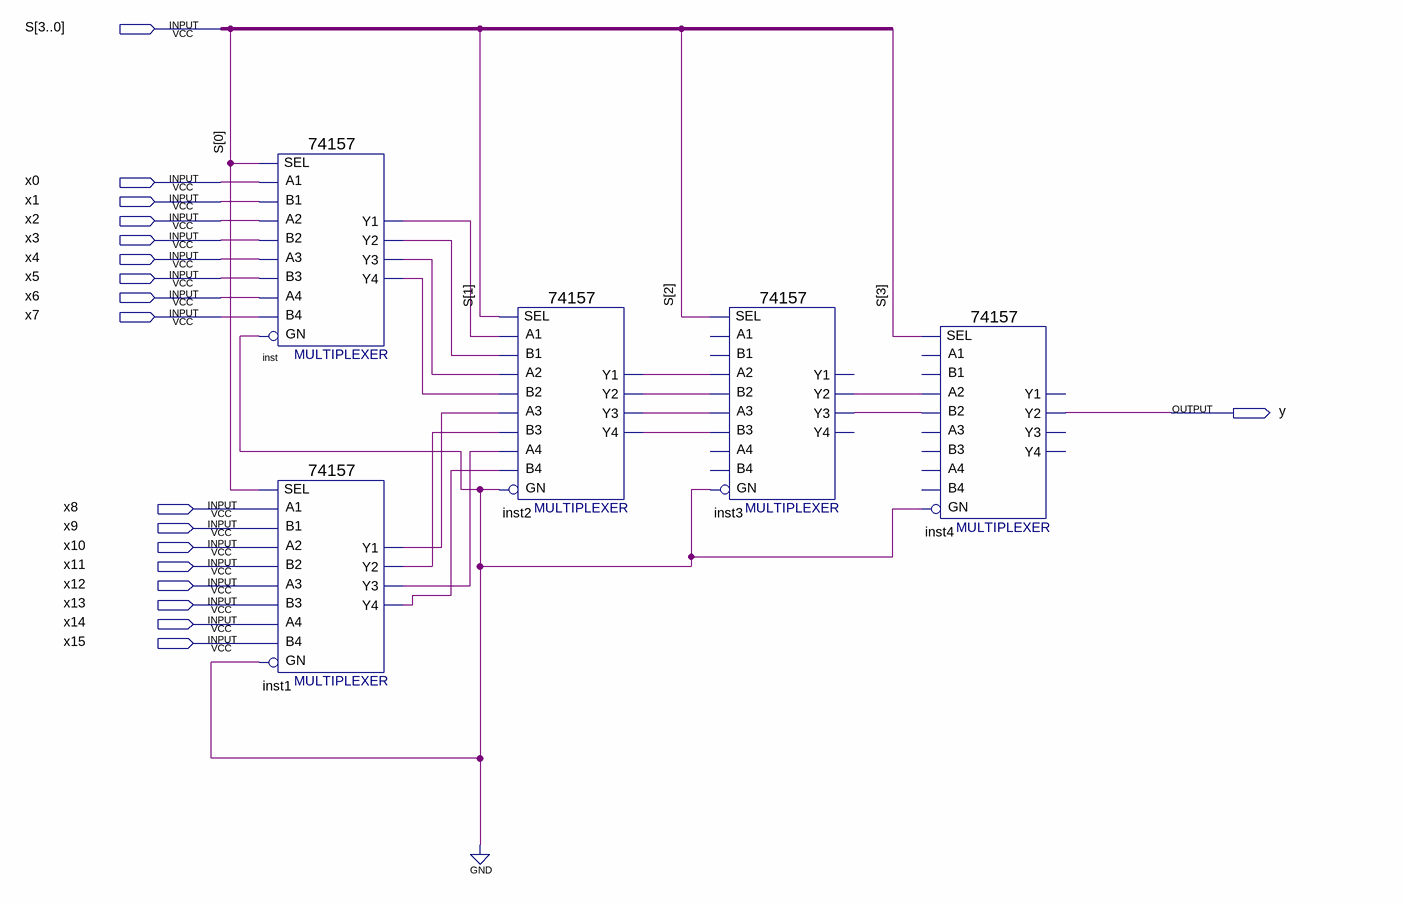
[diagram p0: schematic sheet]
// Quartus schematic mux16_1_e.bdf as structural Verilog: 5 symbols, 18 pins
module mux16_1_e (
  input  [3:0] S,
  input  x0,
  input  x1,
  input  x2,
  input  x3,
  input  x4,
  input  x5,
  input  x6,
  input  x7,
  input  x8,
  input  x9,
  input  x10,
  input  x11,
  input  x12,
  input  x13,
  input  x14,
  input  x15,
  output y
);

  wire inst1_y1, inst1_y2, inst1_y3, inst1_y4, inst2_y1, inst2_y2, inst2_y3, inst2_y4, inst3_y2, inst3_y3,
       inst_y1, inst_y2, inst_y3, inst_y4;

  \74157  inst (
    .A1(x0), .B1(x1), .SEL(S[0]), .B2(x3), .A3(x4), .B3(x5), .A2(x2), .B4(x7), .GN(1'b0), .A4(x6),
    .Y2(inst_y2), .Y1(inst_y1), .Y4(inst_y4), .Y3(inst_y3));
  \74157  inst1 (
    .A1(x8), .B1(x9), .SEL(S[0]), .B2(x11), .A3(x12), .B3(x13), .A2(x10), .B4(x15), .GN(1'b0), .A4(x14),
    .Y2(inst1_y2), .Y1(inst1_y1), .Y4(inst1_y4), .Y3(inst1_y3));
  \74157  inst2 (
    .A1(inst_y1), .B1(inst_y2), .SEL(S[1]), .B2(inst_y4), .A3(inst1_y1), .B3(inst1_y2), .A2(inst_y3),
    .B4(inst1_y4), .GN(1'b0), .A4(inst1_y3), .Y2(inst2_y2), .Y1(inst2_y1), .Y4(inst2_y4), .Y3(inst2_y3));
  \74157  inst3 (
    .SEL(S[2]), .B2(inst2_y2), .A3(inst2_y3), .B3(inst2_y4), .A2(inst2_y1), .GN(1'b0), .Y2(inst3_y2),
    .Y3(inst3_y3));  // open: A1, B1, B4, A4, Y1, Y4
  \74157  inst4 (
    .SEL(S[3]), .B2(inst3_y3), .A2(inst3_y2), .GN(1'b0), .Y2(y));  // open: A1, B1, A3, B3, B4, A4, Y1, Y4, Y3
endmodule
